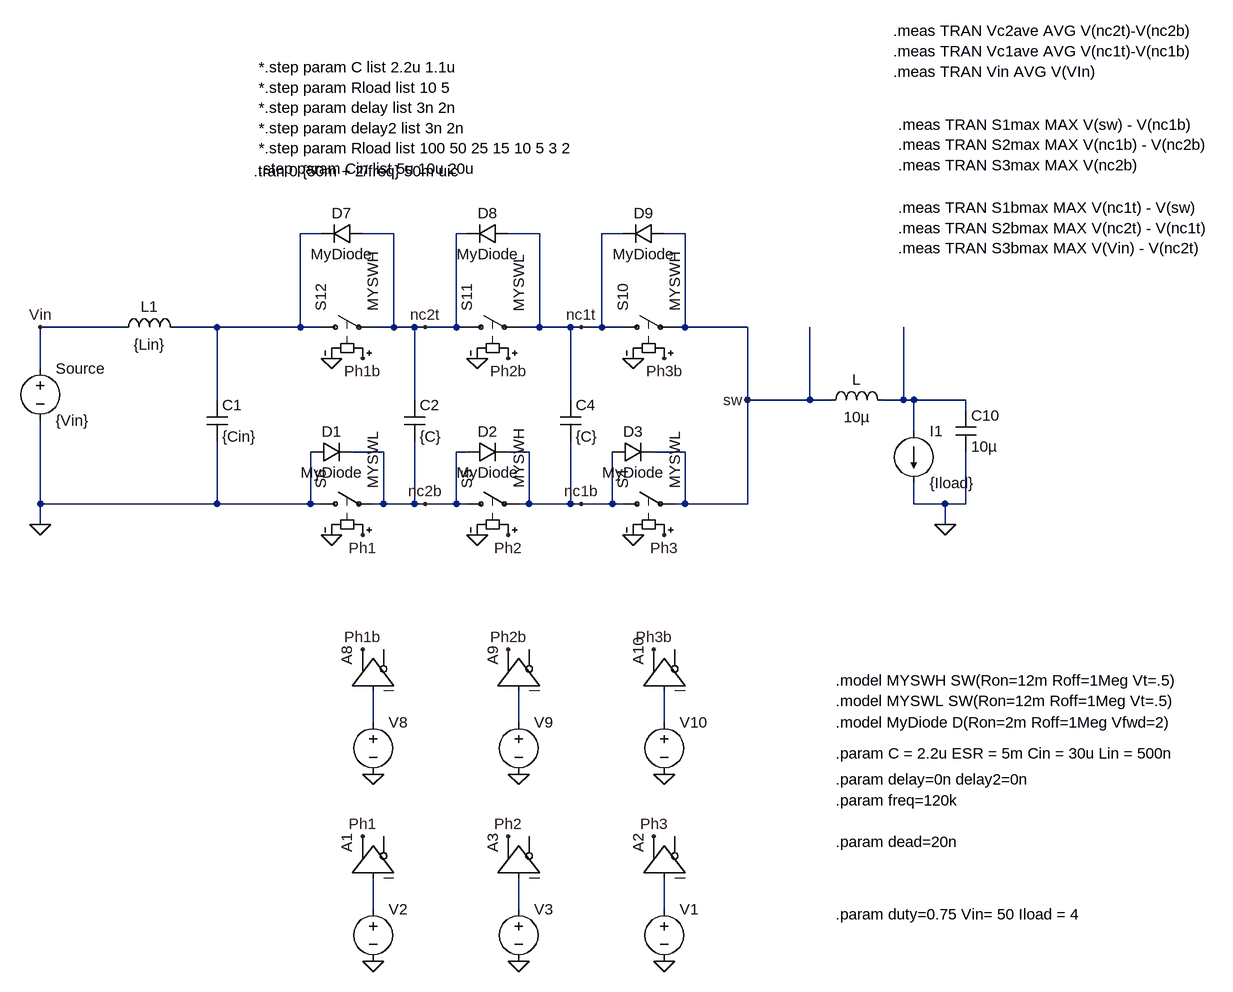
[diagram p0: schematic 4level_input_cap.asc]
4level_input_cap.asc, the LTspice schematic file:
Version 4
SHEET 1 1904 1428
WIRE -1152 -64 -1184 -64
WIRE -1040 -64 -1088 -64
WIRE -928 -64 -944 -64
WIRE -816 -64 -864 -64
WIRE -688 -64 -720 -64
WIRE -592 -64 -624 -64
WIRE -1456 80 -1584 80
WIRE -1312 80 -1376 80
WIRE -1184 80 -1184 -64
WIRE -1184 80 -1312 80
WIRE -1152 80 -1184 80
WIRE -1040 80 -1040 -64
WIRE -1040 80 -1072 80
WIRE -1008 80 -1040 80
WIRE -992 80 -1008 80
WIRE -944 80 -944 -64
WIRE -944 80 -992 80
WIRE -928 80 -944 80
WIRE -816 80 -816 -64
WIRE -816 80 -848 80
WIRE -768 80 -816 80
WIRE -752 80 -768 80
WIRE -720 80 -720 -64
WIRE -720 80 -752 80
WIRE -688 80 -720 80
WIRE -592 80 -592 -64
WIRE -592 80 -608 80
WIRE -496 80 -592 80
WIRE -1584 144 -1584 80
WIRE -1312 192 -1312 80
WIRE -1008 192 -1008 80
WIRE -768 192 -768 80
WIRE -496 192 -496 80
WIRE -400 192 -400 80
WIRE -400 192 -496 192
WIRE -368 192 -400 192
WIRE -256 192 -256 80
WIRE -256 192 -288 192
WIRE -240 192 -256 192
WIRE -160 192 -240 192
WIRE -160 208 -160 192
WIRE -240 240 -240 192
WIRE -1056 272 -1104 272
WIRE -928 272 -944 272
WIRE -832 272 -864 272
WIRE -592 272 -640 272
WIRE -1584 352 -1584 224
WIRE -1312 352 -1312 256
WIRE -1312 352 -1584 352
WIRE -1168 352 -1168 272
WIRE -1168 352 -1312 352
WIRE -1152 352 -1168 352
WIRE -1056 352 -1056 272
WIRE -1056 352 -1072 352
WIRE -1008 352 -1008 256
WIRE -1008 352 -1056 352
WIRE -992 352 -1008 352
WIRE -944 352 -944 272
WIRE -944 352 -992 352
WIRE -928 352 -944 352
WIRE -832 352 -832 272
WIRE -832 352 -848 352
WIRE -768 352 -768 256
WIRE -768 352 -832 352
WIRE -752 352 -768 352
WIRE -704 352 -704 272
WIRE -704 352 -752 352
WIRE -688 352 -704 352
WIRE -592 352 -592 272
WIRE -592 352 -608 352
WIRE -496 352 -496 192
WIRE -496 352 -592 352
WIRE -240 352 -240 320
WIRE -192 352 -240 352
WIRE -160 352 -160 272
WIRE -160 352 -192 352
WIRE -1584 384 -1584 352
WIRE -192 384 -192 352
WIRE -1072 688 -1072 640
WIRE -848 688 -848 640
WIRE -624 688 -624 640
WIRE -1072 976 -1072 928
WIRE -848 976 -848 928
WIRE -624 976 -624 928
FLAG -1072 1056 0
FLAG -1088 864 Ph1
FLAG -1584 80 Vin
FLAG -624 128 Ph3b
FLAG -864 128 Ph2b
FLAG -1088 128 Ph1b
FLAG -1136 128 0
FLAG -912 128 0
FLAG -672 128 0
FLAG -848 1056 0
FLAG -864 864 Ph2
FLAG -624 400 Ph3
FLAG -864 400 Ph2
FLAG -1088 400 Ph1
FLAG -1136 400 0
FLAG -912 400 0
FLAG -672 400 0
FLAG -192 384 0
FLAG -1584 384 0
FLAG -624 1056 0
FLAG -640 864 Ph3
FLAG -1072 768 0
FLAG -1088 576 Ph1b
FLAG -848 768 0
FLAG -864 576 Ph2b
FLAG -624 768 0
FLAG -640 576 Ph3b
FLAG -992 80 nc2t
FLAG -752 80 nc1t
FLAG -992 352 nc2b
FLAG -752 352 nc1b
FLAG -496 192 sw
SYMBOL voltage -1072 960 R0
WINDOW 123 0 0 Left 2
WINDOW 39 0 0 Left 2
WINDOW 3 24 96 Invisible 2
SYMATTR Value PULSE(0 1 0 1p 1p {1/freq*(1-duty)} {1/freq})
SYMATTR InstName V2
SYMBOL Digital\\buf -1136 928 R270
SYMATTR InstName A1
SYMBOL voltage -1584 128 R0
WINDOW 123 0 0 Left 2
WINDOW 39 0 0 Left 2
SYMATTR InstName Source
SYMATTR Value {Vin}
SYMBOL sw -704 80 R270
SYMATTR InstName S10
SYMATTR Value MYSWH
SYMBOL sw -944 80 R270
SYMATTR InstName S11
SYMATTR Value MYSWL
SYMBOL sw -1168 80 R270
SYMATTR InstName S12
SYMATTR Value MYSWH
SYMBOL voltage -848 960 R0
WINDOW 123 0 0 Left 2
WINDOW 39 0 0 Left 2
WINDOW 3 24 96 Invisible 2
SYMATTR Value PULSE(0 1 {1/freq/3+delay} 1p 1p {1/freq*(1-duty)-delay+delay2} {1/freq})
SYMATTR InstName V3
SYMBOL Digital\\buf -912 928 R270
SYMATTR InstName A3
SYMBOL sw -704 352 R270
SYMATTR InstName S4
SYMATTR Value MYSWL
SYMBOL sw -944 352 R270
SYMATTR InstName S5
SYMATTR Value MYSWH
SYMBOL sw -1168 352 R270
SYMATTR InstName S6
SYMATTR Value MYSWL
SYMBOL cap -1024 192 R0
SYMATTR InstName C2
SYMATTR Value {C}
SYMATTR SpiceLine Rser={ESR}
SYMATTR SpiceLine2 IC={Vin/3*1}
SYMBOL cap -784 192 R0
SYMATTR InstName C4
SYMATTR Value {C}
SYMATTR SpiceLine Rser={ESR}
SYMATTR SpiceLine2 IC={Vin/3*2}
SYMBOL ind -384 208 R270
WINDOW 0 32 56 VTop 2
WINDOW 3 5 56 VBottom 2
SYMATTR InstName L
SYMATTR Value 10µ
SYMATTR SpiceLine Rser=20m
SYMATTR SpiceLine2 ic = {Iload}
SYMBOL cap -176 208 R0
SYMATTR InstName C10
SYMATTR Value 10µ
SYMATTR SpiceLine IC={Vin*duty}
SYMATTR SpiceLine2 Rser=1m
SYMBOL voltage -624 960 R0
WINDOW 123 0 0 Left 2
WINDOW 39 0 0 Left 2
WINDOW 3 24 96 Invisible 2
SYMATTR Value PULSE(0 1 {2/freq/3} 1p 1p {1/freq*(1-duty)} {1/freq})
SYMATTR InstName V1
SYMBOL Digital\\buf -688 928 R270
SYMATTR InstName A2
SYMBOL voltage -1072 672 R0
WINDOW 123 0 0 Left 2
WINDOW 39 0 0 Left 2
WINDOW 3 24 96 Invisible 2
SYMATTR Value PULSE(0 1 {1/freq*(1-duty)+dead+delay} 1p 1p {1/freq*duty-dead*2-delay+delay2} {1/freq})
SYMATTR InstName V8
SYMBOL Digital\\buf -1136 640 R270
SYMATTR InstName A8
SYMBOL voltage -848 672 R0
WINDOW 123 0 0 Left 2
WINDOW 39 0 0 Left 2
WINDOW 3 24 96 Invisible 2
SYMATTR Value PULSE(0 1 {1/freq/3+1/freq*(1-duty)+dead} 1p 1p {1/freq*duty-dead*2} {1/freq})
SYMATTR InstName V9
SYMBOL Digital\\buf -912 640 R270
SYMATTR InstName A9
SYMBOL voltage -624 672 R0
WINDOW 123 0 0 Left 2
WINDOW 39 0 0 Left 2
WINDOW 3 24 44 Invisible 2
SYMATTR Value PULSE(0 1 {2/freq/3+1/freq*(1-duty)+dead+delay} 1p 1p {1/freq*duty-dead*2-delay+delay2} {1/freq})
SYMATTR InstName V10
SYMBOL Digital\\buf -688 640 R270
SYMATTR InstName A10
SYMBOL diode -1168 288 R270
WINDOW 0 32 32 VTop 2
WINDOW 3 0 32 VBottom 2
SYMATTR InstName D1
SYMATTR Value MyDiode
SYMBOL diode -928 288 R270
WINDOW 0 32 32 VTop 2
WINDOW 3 0 32 VBottom 2
SYMATTR InstName D2
SYMATTR Value MyDiode
SYMBOL diode -704 288 R270
WINDOW 0 32 32 VTop 2
WINDOW 3 0 32 VBottom 2
SYMATTR InstName D3
SYMATTR Value MyDiode
SYMBOL diode -1088 -80 R90
WINDOW 0 0 32 VBottom 2
WINDOW 3 32 32 VTop 2
SYMATTR InstName D7
SYMATTR Value MyDiode
SYMBOL diode -864 -80 R90
WINDOW 0 0 32 VBottom 2
WINDOW 3 32 32 VTop 2
SYMATTR InstName D8
SYMATTR Value MyDiode
SYMBOL diode -624 -80 R90
WINDOW 0 0 32 VBottom 2
WINDOW 3 32 32 VTop 2
SYMATTR InstName D9
SYMATTR Value MyDiode
SYMBOL current -240 240 R0
WINDOW 123 0 0 Left 2
WINDOW 39 0 0 Left 2
SYMATTR InstName I1
SYMATTR Value {Iload}
SYMBOL cap -1328 192 R0
SYMATTR InstName C1
SYMATTR Value {Cin}
SYMATTR SpiceLine Rser={ESR}
SYMATTR SpiceLine2 IC={Vin}
SYMBOL ind -1472 96 R270
WINDOW 0 32 56 VTop 2
WINDOW 3 5 56 VBottom 2
SYMATTR InstName L1
SYMATTR Value {Lin}
TEXT -1256 -160 Left 2 !.tran 0 {50m + 2/freq} 50m uic
TEXT -360 624 Left 2 !.model MYSWH SW(Ron=12m Roff=1Meg Vt=.5)\n.model MYSWL SW(Ron=12m Roff=1Meg Vt=.5)
TEXT -360 688 Left 2 !.model MyDiode D(Ron=2m Roff=1Meg Vfwd=2)
TEXT -360 776 Left 2 !.param delay=0n delay2=0n
TEXT -360 808 Left 2 !.param freq=120k
TEXT -360 984 Left 2 !.param duty=0.75 Vin= 50 Iload = 4
TEXT -360 872 Left 2 !.param dead=20n
TEXT -360 736 Left 2 !.param C = 2.2u ESR = 5m Cin = 30u Lin = 500n
TEXT -264 -232 Left 2 !.meas TRAN S1max MAX V(sw) - V(nc1b)\n.meas TRAN S2max MAX V(nc1b) - V(nc2b)\n.meas TRAN S3max MAX V(nc2b)
TEXT -272 -376 Left 2 !.meas TRAN Vc2ave AVG V(nc2t)-V(nc2b)\n.meas TRAN Vc1ave AVG V(nc1t)-V(nc1b)\n.meas TRAN Vin AVG V(VIn)
TEXT -264 -104 Left 2 !.meas TRAN S1bmax MAX V(nc1t) - V(sw) \n.meas TRAN S2bmax MAX V(nc2t) - V(nc1t) \n.meas TRAN S3bmax MAX V(Vin) - V(nc2t)
TEXT -1248 -320 Left 2 !*.step param C list 2.2u 1.1u\n*.step param Rload list 10 5\n*.step param delay list 3n 2n\n*.step param delay2 list 3n 2n\n*.step param Rload list 100 50 25 15 10 5 3 2\n.step param Cin list 5u 10u 20u

The netlist it stands for:
* 4level_input_cap.asc
V2 N006 0 PULSE(0 1 0 1p 1p {1/freq*(1-duty)} {1/freq})
A1 N006 0 0 0 0 0 Ph1 0 BUF
V§Source Vin 0 {Vin}
S10 nc1t sw Ph3b 0 MYSWH
S11 nc2t nc1t Ph2b 0 MYSWL
S12 N001 nc2t Ph1b 0 MYSWH
V3 N007 0 PULSE(0 1 {1/freq/3+delay} 1p 1p {1/freq*(1-duty)-delay+delay2} {1/freq})
A3 N007 0 0 0 0 0 Ph2 0 BUF
S4 nc1b sw Ph3 0 MYSWL
S5 nc2b nc1b Ph2 0 MYSWH
S6 0 nc2b Ph1 0 MYSWL
C2 nc2t nc2b {C} Rser={ESR} IC={Vin/3*1}
C4 nc1t nc1b {C} Rser={ESR} IC={Vin/3*2}
L sw N002 10µ Rser=20m ic = {Iload}
C10 N002 0 10µ IC={Vin*duty} Rser=1m
V1 N008 0 PULSE(0 1 {2/freq/3} 1p 1p {1/freq*(1-duty)} {1/freq})
A2 N008 0 0 0 0 0 Ph3 0 BUF
V8 N003 0 PULSE(0 1 {1/freq*(1-duty)+dead+delay} 1p 1p {1/freq*duty-dead*2-delay+delay2} {1/freq})
A8 N003 0 0 0 0 0 Ph1b 0 BUF
V9 N004 0 PULSE(0 1 {1/freq/3+1/freq*(1-duty)+dead} 1p 1p {1/freq*duty-dead*2} {1/freq})
A9 N004 0 0 0 0 0 Ph2b 0 BUF
V10 N005 0 PULSE(0 1 {2/freq/3+1/freq*(1-duty)+dead+delay} 1p 1p {1/freq*duty-dead*2-delay+delay2} {1/freq})
A10 N005 0 0 0 0 0 Ph3b 0 BUF
D1 0 nc2b MyDiode
D2 nc2b nc1b MyDiode
D3 nc1b sw MyDiode
D7 nc2t N001 MyDiode
D8 nc1t nc2t MyDiode
D9 sw nc1t MyDiode
I1 N002 0 {Iload}
C1 N001 0 {Cin} Rser={ESR} IC={Vin}
L1 Vin N001 {Lin}
.model D D
.lib standard.dio
.tran 0 {50m + 2/freq} 50m uic
.model MYSWH SW(Ron=12m Roff=1Meg Vt=.5)
.model MYSWL SW(Ron=12m Roff=1Meg Vt=.5)
.model MyDiode D(Ron=2m Roff=1Meg Vfwd=2)
.param delay=0n delay2=0n
.param freq=120k
.param duty=0.75 Vin= 50 Iload = 4
.param dead=20n
.param C = 2.2u ESR = 5m Cin = 30u Lin = 500n
.meas TRAN S1max MAX V(sw) - V(nc1b)
.meas TRAN S2max MAX V(nc1b) - V(nc2b)
.meas TRAN S3max MAX V(nc2b)
.meas TRAN Vc2ave AVG V(nc2t)-V(nc2b)
.meas TRAN Vc1ave AVG V(nc1t)-V(nc1b)
.meas TRAN Vin AVG V(VIn)
.meas TRAN S1bmax MAX V(nc1t) - V(sw)
.meas TRAN S2bmax MAX V(nc2t) - V(nc1t)
.meas TRAN S3bmax MAX V(Vin) - V(nc2t)
*.step param C list 2.2u 1.1u
*.step param Rload list 10 5
*.step param delay list 3n 2n
*.step param delay2 list 3n 2n
*.step param Rload list 100 50 25 15 10 5 3 2
.step param Cin list 5u 10u 20u
.backanno
.end